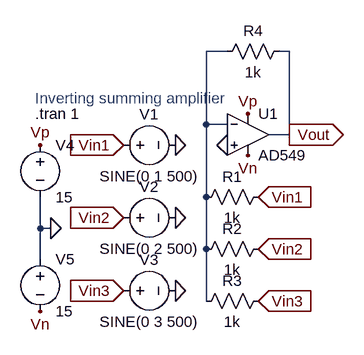
[diagram p0: schematic sch.asc]
sch.asc, the LTspice schematic file:
Version 4
SHEET 1 880 680
WIRE 192 48 160 48
WIRE 288 48 272 48
WIRE 160 160 160 48
WIRE 192 160 160 160
WIRE 288 176 288 48
WIRE 288 176 256 176
WIRE 160 272 160 160
WIRE -96 320 -96 272
WIRE -80 320 -96 320
WIRE 160 352 160 272
WIRE -96 368 -96 320
WIRE 160 432 160 352
FLAG 192 192 0
FLAG 112 192 0
FLAG 112 304 0
FLAG 112 416 0
FLAG -80 320 0
FLAG -96 192 Vp
FLAG 224 144 Vp
FLAG -96 448 Vn
FLAG 224 208 Vn
FLAG 32 192 Vin1
IOPIN 32 192 In
FLAG 240 272 Vin1
IOPIN 240 272 In
FLAG 32 304 Vin2
IOPIN 32 304 In
FLAG 240 352 Vin2
IOPIN 240 352 In
FLAG 32 416 Vin3
IOPIN 32 416 In
FLAG 240 432 Vin3
IOPIN 240 432 In
FLAG 288 176 Vout
IOPIN 288 176 Out
SYMBOL OpAmps\\AD549 224 112 R0
SYMATTR InstName U1
SYMBOL res 144 288 R270
WINDOW 0 32 56 VTop 2
WINDOW 3 0 56 VBottom 2
SYMATTR InstName R1
SYMATTR Value 1k
SYMBOL res 144 368 R270
WINDOW 0 32 56 VTop 2
WINDOW 3 0 56 VBottom 2
SYMATTR InstName R2
SYMATTR Value 1k
SYMBOL res 144 448 R270
WINDOW 0 32 56 VTop 2
WINDOW 3 0 56 VBottom 2
SYMATTR InstName R3
SYMATTR Value 1k
SYMBOL res 288 32 R90
WINDOW 0 0 56 VBottom 2
WINDOW 3 32 56 VTop 2
SYMATTR InstName R4
SYMATTR Value 1k
SYMBOL voltage 16 192 R270
WINDOW 0 32 56 VTop 2
WINDOW 3 -32 56 VBottom 2
WINDOW 123 0 0 Left 0
WINDOW 39 0 0 Left 0
SYMATTR InstName V1
SYMATTR Value SINE(0 1 500)
SYMBOL voltage 16 304 R270
WINDOW 0 32 56 VTop 2
WINDOW 3 -32 56 VBottom 2
WINDOW 123 0 0 Left 0
WINDOW 39 0 0 Left 0
SYMATTR InstName V2
SYMATTR Value SINE(0 2 500)
SYMBOL voltage 16 416 R270
WINDOW 0 32 56 VTop 2
WINDOW 3 -32 56 VBottom 2
WINDOW 123 0 0 Left 0
WINDOW 39 0 0 Left 0
SYMATTR InstName V3
SYMATTR Value SINE(0 3 500)
SYMBOL voltage -96 176 R0
WINDOW 123 0 0 Left 0
WINDOW 39 0 0 Left 0
SYMATTR InstName V4
SYMATTR Value 15
SYMBOL voltage -96 352 R0
WINDOW 123 0 0 Left 0
WINDOW 39 0 0 Left 0
SYMATTR InstName V5
SYMATTR Value 15
TEXT -104 120 Left 2 ;Inverting summing amplifier
TEXT -104 144 Left 2 !.tran 1

The netlist it stands for:
* sch.asc
XU1 0 N001 Vp Vn Vout AD549  ; pins In+ In- V+ V- OUT
R1 N001 Vin1 1k
R2 N001 Vin2 1k
R3 N001 Vin3 1k
R4 Vout N001 1k
V1 Vin1 0 SINE(0 1 500)
V2 Vin2 0 SINE(0 2 500)
V3 Vin3 0 SINE(0 3 500)
V4 Vp 0 15
V5 0 Vn 15
* Inverting summing amplifier
.tran 1
.backanno
.end